# EAGLE design Omniboard (EAGLE 7.5.0)
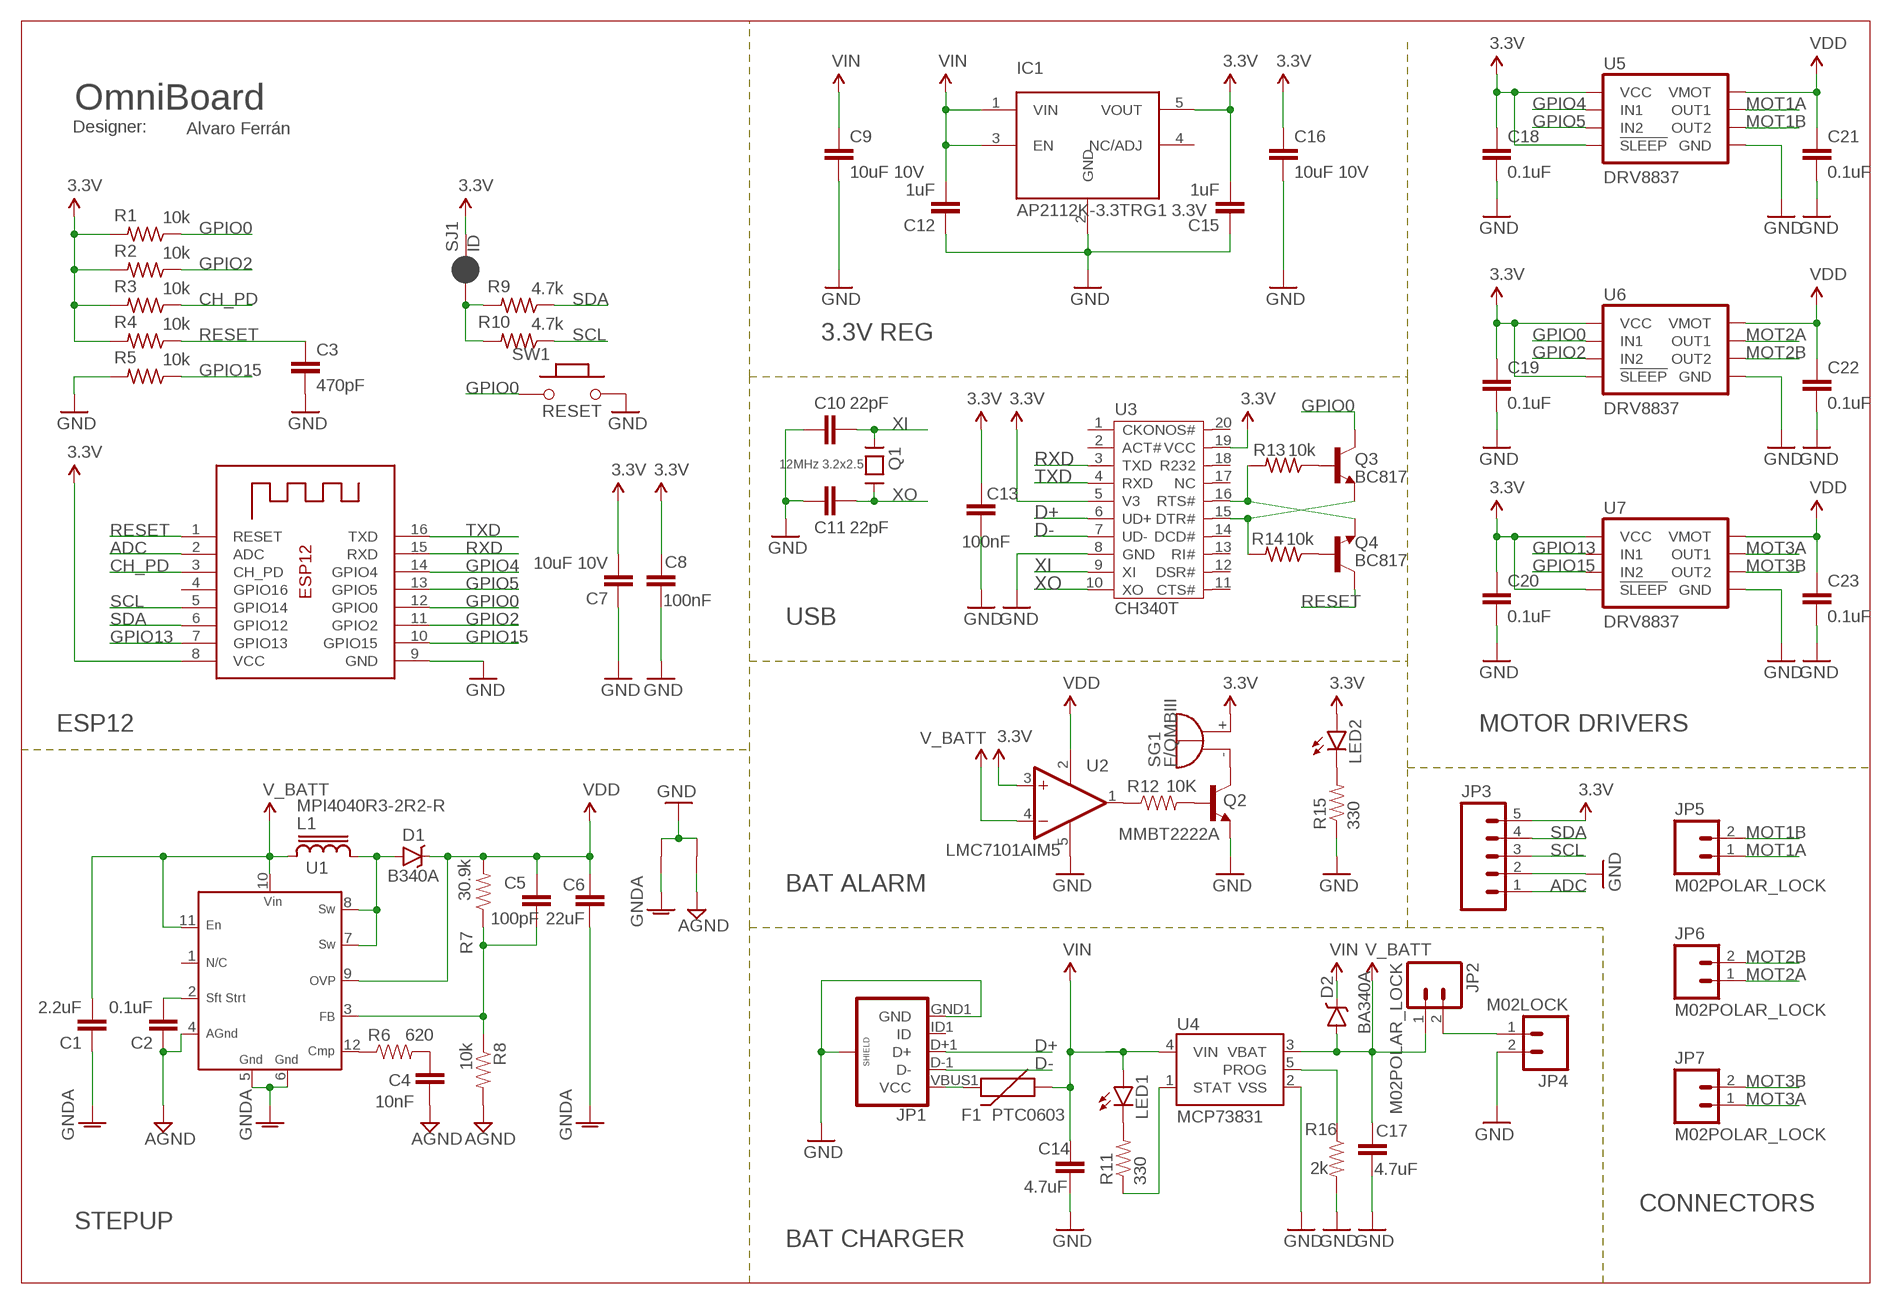
[diagram p0: schematic, sheet 1]

## Parts
C1  2.2uF  CAP0603-CAP  [0603-CAP]
C2  0.1uF  CAP0603-CAP  [0603-CAP]
C3  470pF  CAP0402-CAP  [0402-CAP]
C4  10nF  CAP0603-CAP  [0603-CAP]
C5  100pF  CAP0603-CAP  [0603-CAP]
C6  22uF  22UF-6.3V-20%(0805)  [0805]
C7  10uF 10V  CAP0402-CAP  [0402-CAP]
C8  100nF  CAP0402-CAP  [0402-CAP]
C9  10uF 10V  CAP0603-CAP  [0603-CAP]
C10  22pF  CAP0402-CAP  [0402-CAP]
C11  22pF  CAP0402-CAP  [0402-CAP]
C12  1uF  CAP0603-CAP  [0603-CAP]
C13  100nF  CAP0402-CAP  [0402-CAP]
C14  4.7uF  CAP0402-CAP  [0402-CAP]
C15  1uF  CAP0603-CAP  [0603-CAP]
C16  10uF 10V  CAP0603-CAP  [0603-CAP]
C17  4.7uF  CAP0402-CAP  [0402-CAP]
C18  0.1uF  0.1UF-16V(+-10%)(0402)  [0402-CAP]
C19  0.1uF  0.1UF-16V(+-10%)(0402)  [0402-CAP]
C20  0.1uF  0.1UF-16V(+-10%)(0402)  [0402-CAP]
C21  0.1uF  0.1UF-16V(+-10%)(0402)  [0402-CAP]
C22  0.1uF  0.1UF-16V(+-10%)(0402)  [0402-CAP]
C23  0.1uF  0.1UF-16V(+-10%)(0402)  [0402-CAP]
D1  B340A  DIODE-SCHOTTKY-B340A  [SMA-DIODE]
D2  BA340A  B340A  [SMA-DIODE]
F1  PTC0603  [0603]
GND10  VIRTUAL_GND  [STARGND]
GND13  VIRTUAL_GND  [STARGND]
IC1  AP2112K-3.3TRG1 3.3V  5PIN_REG  [SOT23-5]
JP1  USB_MICROB  USB_MICROB_PLUGCONN-11752  [USB-B-MICRO-SMD_V03]
JP2  M02POLAR_LOCK  [MOLEX-1X2_LOCK]
JP3  M05LOCK  [1X05_LOCK]
JP4  M02LOCK  [1X02_LOCK]
JP5  M02POLAR_LOCK  [MOLEX-1X2_LOCK]
JP6  M02POLAR_LOCK  [MOLEX-1X2_LOCK]
JP7  M02POLAR_LOCK  [MOLEX-1X2_LOCK]
L1  MPI4040R3-2R2-R  [MPI4040R3-2R2-R]
LED1  LED0603  [LED-0603]
LED2  LED0603  [LED-0603]
Q1  12MHz 3.2x2.5  CRYSTAL3.2X2.5  [CRYSTAL_3.2X2.5]
Q2  MMBT2222A  TRANSISTOR_NPNMMBT2222A  [SOT23-3]
Q3  BC817  BC817-16SMD  [SOT23-BEC]
Q4  BC817  BC817-16SMD  [SOT23-BEC]
R1  10k  R-US_R0402  [R0402]
R2  10k  R-US_R0402  [R0402]
R3  10k  R-US_R0402  [R0402]
R4  10k  R-US_R0402  [R0402]
R5  10k  R-US_R0402  [R0402]
R6  620  RESISTOR0603-RES  [0603-RES]
R7  30.9k  RESISTOR0603-RES  [0603-RES]
R8  10k  RESISTOR0603-RES  [0603-RES]
R9  4.7k  R-US_R0402  [R0402]
R10  4.7k  R-US_R0402  [R0402]
R11  330  RESISTOR0402-RES  [0402-RES]
R12  10K  RESISTOR0402-RES  [0402-RES]
R13  10k  R-US_R0402  [R0402]
R14  10k  R-US_R0402  [R0402]
R15  330  RESISTOR0402-RES  [0402-RES]
R16  2k  RESISTOR0402-RES  [0402-RES]
SG1  F/QMBIII  [F/QMBIII]
SJ1  ID  JUMPER-PAD-2-NC_BY_PASTE  [PAD-JUMPER-2-NC_BY_PASTE_YES_SILK]
SW1  RESET  PB157  [157SW]
U1  MIC2253  [MLF12_3.0MM_X_3.0MM]
U2  LMC7101AIM5  [SOT23-5]
U3  CH340T  [SSOP20]
U4  MCP73831  [SOT23-5]
U5  DRV8837  [DSG]
U6  DRV8837  [DSG]
U7  DRV8837  [DSG]
X1  ESP-12  [ESP-12]

## Nets
3.3V: C7.2 C8.1 C13.2 C15.2 C16.1 C18.1 C19.1 C20.1 IC1.5(VOUT) JP3.5 LED2.A R1.2 R2.2 R3.2 R4.2 SG1.+(-) SJ1.2 U2.3(+IN) U3.5(V3) U3.19(VCC) U5.7(!SLEEP) U5.8(VCC) U6.7(!SLEEP) U6.8(VCC) U7.7(!SLEEP) U7.8(VCC) X1.8(VCC)
ADC: JP3.1 X1.2(ADC)
AGND: C2.1 C4.1 GND13.P$1 R8.2 U1.4(AGND)
CH_PD: R3.1 X1.3(CH_PD)
D+: JP1.D+1(D+) U3.6(UD+)
D-: JP1.D-1(D-) U3.7(UD-)
GND: C3.2 C7.1 C8.2 C9.2 C10.1 C11.1 C12.1 C13.1 C14.2 C15.1 C16.2 C17.2 C18.2 C19.2 C20.2 C21.2 C22.2 C23.2 GND10.P$2 GND13.P$2 IC1.2(GND) JP1.GND1(GND) JP1.SHIELD1(SHIELD) JP1.SHIELD2(SHIELD) JP1.SHIELD3(SHIELD) JP3.2 JP4.2 Q2.2(E) R5.2 R15.1 R16.2 SW1.2 U2.5(V-) U3.8(GND) U4.2(VSS) U5.4(GND) U5.PAD(GND) U6.4(GND) U6.PAD(GND) U7.4(GND) U7.PAD(GND) X1.9(GND)
GPIO0: Q3.C R1.1 SW1.1 U6.6(IN1) X1.12(GPIO0)
GPIO2: R2.1 U6.5(IN2) X1.11(GPIO2)
GPIO4: U5.6(IN1) X1.14(GPIO4)
GPIO5: U5.5(IN2) X1.13(GPIO5)
GPIO13: U7.6(IN1) X1.7(GPIO13)
GPIO15: R5.1 U7.5(IN2) X1.10(GPIO15)
MOT1A: JP5.1 U5.2(OUT1)
MOT1B: JP5.2 U5.3(OUT2)
MOT2A: JP6.1 U6.2(OUT1)
MOT2B: JP6.2 U6.3(OUT2)
MOT3A: JP7.1 U7.2(OUT1)
MOT3B: JP7.2 U7.3(OUT2)
N$1: R9.2 R10.2 SJ1.1
N$2: Q3.E R14.2 U3.15(DTR#)
N$3: C4.2 R6.2
N$4: C2.2 U1.2(SS)
N$5: LED1.C R11.2
N$6: Q3.B R13.1
N$7: Q4.B R14.1
N$8: Q2.1(B) R12.2
N$9: Q2.3(C) SG1.-(+)
N$10: Q4.E R13.2 U3.16(RTS#)
N$11: R16.1 U4.5(PROG)
N$12: D1.A L1.P$2 U1.7(SW) U1.8(SW)
N$13: R11.1 U4.1(STAT)
N$14: F1.2 JP1.VBUS1(VCC)
N$15: LED2.C R15.2
N$16: R6.1 U1.12(CMP)
N$17: R12.1 U2.1(OUT)
N$24: C5.1 R7.1 R8.1 U1.3(FB)
PGND: C1.1 C6.1 GND10.P$1 U1.5(GND) U1.6(GND) ; supply symbol labelled GNDA
RESET: C3.1 Q4.C R4.1 X1.1(RESET)
RXD: U3.3(TXD) X1.15(RXD)
SCL: JP3.3 R10.1 X1.5(GPIO14)
SDA: JP3.4 R9.1 X1.6(GPIO12)
TXD: U3.4(RXD) X1.16(TXD)
V_BATT: C1.2 C17.1 D2.A JP2.1 L1.P$1 U1.10(VIN) U1.11(EN) U2.4(-IN) U4.3(VBAT)
VBAT: JP2.2 JP4.1
VDD: C5.2 C6.2 C21.1 C22.1 C23.1 D1.C R7.2 U1.9(OVP) U2.2(V+) U5.1(VMOT) U6.1(VMOT) U7.1(VMOT)
VIN: C9.1 C12.2 C14.1 D2.C F1.1 IC1.1(VIN) IC1.3(EN) LED1.A U4.4(VIN)
XI: C10.2 Q1.3 U3.9(XI)
XO: C11.2 Q1.1 U3.10(XO)
Unconnected: IC1.4(NC/ADJ) JP1.ID1(ID) U1.1(NC) U3.1(CKO) U3.2(ACT#) U3.11(CTS#) U3.12(DSR#) U3.13(RI#) U3.14(DCD#) U3.17(NC) U3.18(R232) U3.20(NOS#) X1.4(GPIO16)

## Notes on the sheet
- OmniBoard
- Designer: | Alvaro Ferrán
- 3.3V REG
- USB
- ESP12 | MOTOR DRIVERS
- BAT ALARM
- CONNECTORS
- STEPUP
- BAT CHARGER

## Library data of the parts
C1-C5 C7-C17 = SparkFun-Passives:CAP: Capacitor Standard 0603 ceramic capacitor, and 0.1" leaded capacitor.
C6 = SparkFun-Capacitors:22UF-6.3V-20%(0805): CAP-08402 Ceramic; PROD_ID: CAP-08402
C18-C23 = SparkFun-Capacitors:0.1UF-16V(+-10%)(0402); PROD_ID: CAP-12416
D1 = SparkFun-DiscreteSemi:DIODE-SCHOTTKY: Schottky diodes in SFE's production catalog BAT20J 1A 23V 0.62Vf RB751 120mA 40V 0.37Vf PMEG4005EJ 0.5A 40V 0.42Vf MBRA140 1A 40V 0.5Vf B340A 3A 40V SMA; PROD_ID: DIO-09886
D2 = SparkFun-DiscreteSemi:B340A: Schottky Diode 3A-40V; PROD_ID: DIO-09886
F1 = SparkFun-PowerIC:PTC: Resettable Fuse PTC Resettable Fuse. Spark Fun Electronics SKU : COM-08357
GND10 GND13 = alvaroferran:VIRTUAL_GND
IC1 = GHI:5PIN_REG
JP1 = SparkFun-Connectors:USB_MICROB_PLUG: USB Micro-B connectors Some male, some female. Watch your step!; PROD_ID: CONN-11752
JP2 JP4-JP7 = SparkFun-Connectors:M02: Standard 2-pin 0.1" header. Use with - straight break away headers ( PRT-00116) - right angle break away headers (PRT-00553) - swiss pins (PRT-00743) - machine pins (PRT-00117) - female headers (PRT-00115) Molex polarized connector foot print use with: PRT-08233 with associated crimp pins and housings. 2.54_SCREWTERM for use with PRT-10571. 3.5mm Screw Terminal footprints for PRT-08084 5mm Screw Terminal footprints for use with PRT-08432
JP3 = SparkFun-Connectors:M05: Header 5 Standard 5-pin 0.1" header. Use with straight break away headers (SKU : PRT-00116), right angle break away headers (PRT-00553), swiss pins (PRT-00743), machine pins (PRT-00117), and female headers (PRT-00115). Molex polarized connector foot print use with SKU : PRT-08230 with associated crimp pins and housings.
L1 = inductor-Eaton Bussmann:MPI4040R3-2R2-R
LED1 LED2 = SparkFun-LED:LED: LEDs Standard schematic elements and footprints for 5mm, 3mm, 1206, and 0603 sized LEDs. 5mm - Spark Fun Electronics SKU : COM-00529 (and others)
Q1 = GHI:CRYSTAL3.2X2.5
Q2 = SparkFun-DiscreteSemi:TRANSISTOR_NPN: Generic NPN BJT MMBT2222A - TRANS-08049 (SOT-23, 1A 40V) MPSA42 - TRANS-09116 (SOT-23, 500mA 300V) MMBT5088LT1G - TRANS-11160 (SOT-23, 50 mA 30V) BC547 - COM-08928 <http://www.sparkfun.com/products/8928> (TO-92 45V 100mA) (1.Collector 2.Base 3.Emitter) 2N3904 - COM-00521 <http://www.sparkfun.com/products/521> (TO-92 40V 200mA) (1.Emitter 2.Base 3.Collector) P2N2222A - COM-12852 <http://www.sparkfun.com/products/12852> (TO-92 40V 600mA) (1.Collector 2.Base 3.Emitter); PROD_ID: TRANS-08049
Q3 Q4 = transistor-npn:BC817*: NPN Transistor
R1-R5 R9 R10 R13 R14 = resistor:R-US_: RESISTOR, American symbol
R6-R8 R11 R15 R16 = SparkFun-Passives:RESISTOR: Resistor Basic schematic elements and footprints for 0603, 1206, and PTH resistors.
R12 = SparkFun:RESISTOR: Resistor Basic schematic elements and footprints for 0603, 1206, and PTH resistors.
SG1 = buzzer:F/QMBIII: BUZZER Source: Buerklin; OC_FARNELL: unknown; OC_NEWARK: unknown
SJ1 = SparkFun-Passives:JUMPER-PAD-2-NC_BY_PASTE
SW1 = MySMD:PB157
U1 = MIC2253_MLF12:MIC2253: MIC2253 - 3.5A, 1 MHz High Efficiency, Variable Voltage Inuput Boost Regulator with Over Voltage Protection and Soft-Start, Micrel 02-13-2013 - troneeee@gmail.com
U2 = linear:LMC7101AIM5
U3 = template:CH340T
U4 = SparkFun-PowerIC:MCP73831: Miniature single cell, fully integrated Li-Ion, Li-polymer charge management controller http://ww1.microchip.com/downloads/en/DeviceDoc/21984a.pdf IC-09995; PROD_ID: IC-09995
U5-U7 = packages(ti):DRV8837
X1 = microbuilder:ESP-12

## Net classes
0 default: width 0.254 mm, drill 0.254 mm, clearance 0.203 mm

## Board
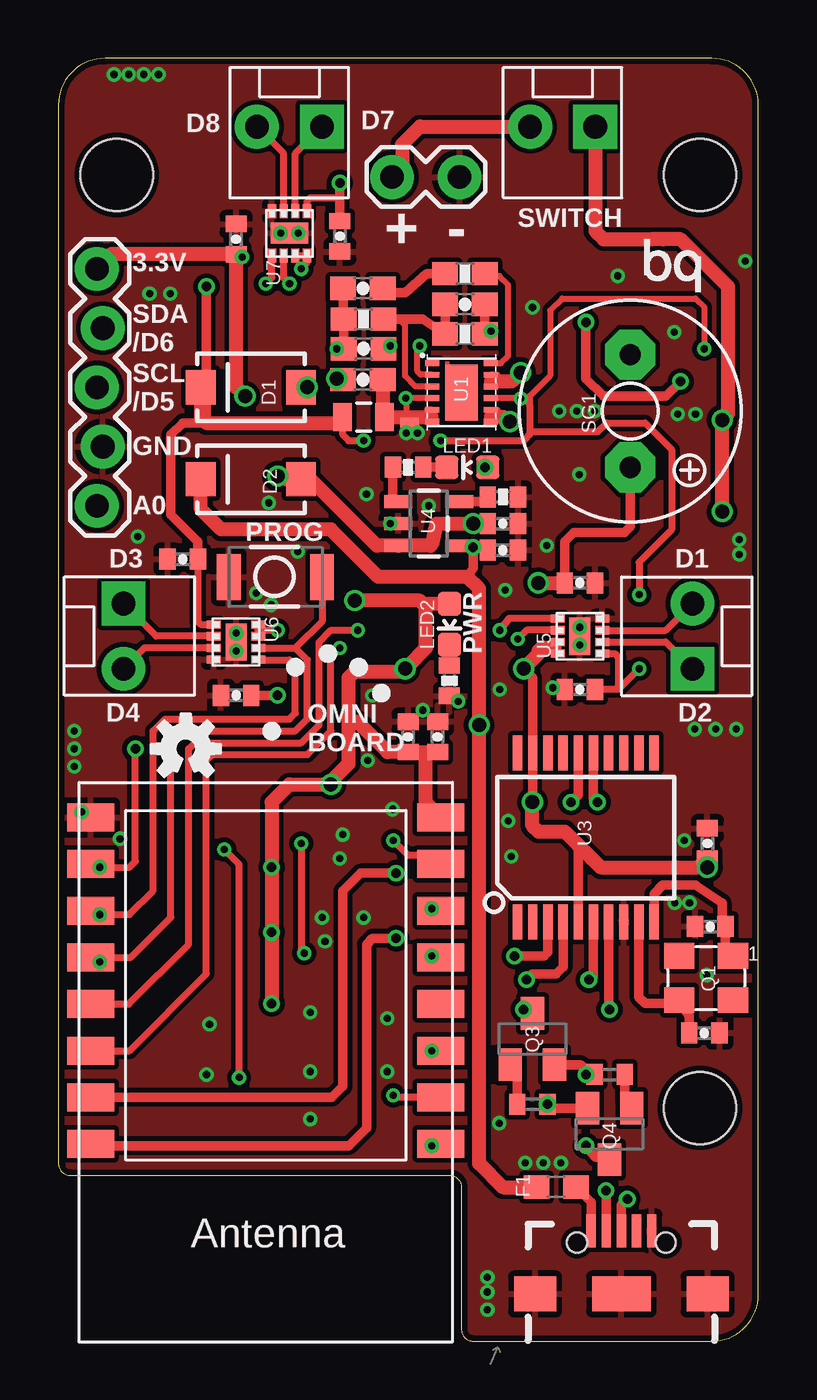
[diagram p1: board, top side]
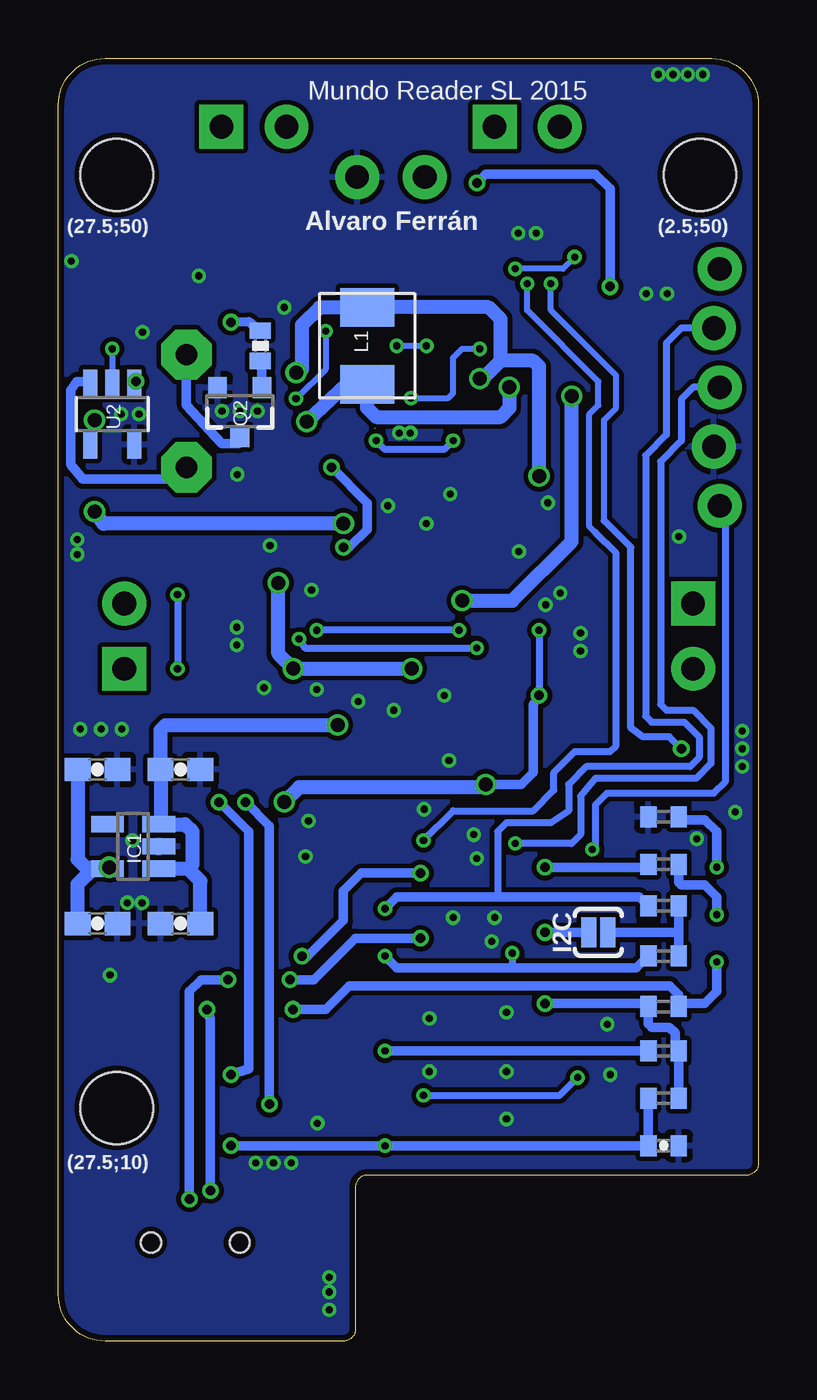
[diagram p2: board, bottom side, seen from below]

Size 30 x 55 mm. Coordinates in mm from the lower left corner, seen from the top.
Outline: 17.78,0 28,0 arc90 30,2 30,53 arc90 28,55 2,55 arc90 0,53 0,7.62 arc90 0.51,7.11 16.76,7.11 arc-90 17.27,6.6 17.27,0.51 arc90 17.78,0
Copper layers (1*16): Top 0.035mm / dielectric 1.5mm / Bottom 0.035mm
Design rules "pighixxx_CAM_DRC_V1.0": minimum track width 6mil, minimum drill 12mil, track to track 6mil, track to pad 6mil, pad to pad 6mil, via to via 6mil, smd to smd 0mil, copper to edge 10mil, drill to drill 10mil, minimum pad ring 10mil, minimum via ring 6mil, stop-mask expansion 2mil, vias tented up to drill 100mil, thermal gap 10mil
Holes 3.1 mm at 2.5,50 27.5,50 27.5,10

### Footprints (pad centres in the part's own frame; a part is rotated, then mirrored left to right if it is on the bottom)
0603-CAP = smd 1.1 x 1: 1 -0.85,0; 2 0.85,0
0402-CAP = smd 0.7 x 0.9: 1 -0.65,0; 2 0.65,0
0805 = smd 0.8 x 1.2: 1 -0.9,0; 2 0.9,0
SMA-DIODE = smd 1.27 x 1.47: A -2.15,0; C 2.15,0
0603 = smd 1.1 x 1: 1 -0.85,0; 2 0.85,0
STARGND = smd 0.203 x 0.406: P$1 -0.102,0; P$2 0.102,0
SOT23-5 = smd 0.7 x 1.4: 1 0.95,1.1; 2 0,1.1; 3 -0.95,1.1; 4 -0.95,-1.1; 5 0.95,-1.1
USB-B-MICRO-SMD_V03 = smd 1.4 x 0.4: D+1 2.7,0; D-1 2.7,0.65; GND1 2.7,-1.3; ID1 2.7,-0.65; VBUS1 2.7,1.3 | smd 1.5 x 1.8: SHIELD1 0,3.7; SHIELD2 0,-3.7 | smd 1.5 x 2.5: SHIELD3 0,0 | hole 0.85: 2.2,1.9; 2.2,-1.9
MOLEX-1X2_LOCK = drill 1.016 pad 1.88 square: 1 -0.127,0 | drill 1.016 pad 1.88: 2 2.667,0
1X05_LOCK = drill 1.016 pad 1.88: 1 0,0.127; 2 2.54,-0.127; 3 5.08,0.127; 4 7.62,-0.127; 5 10.16,0.127
1X02_LOCK = drill 1.016 pad 1.88: 1 -0.178,0; 2 2.718,0
MPI4040R3-2R2-R = smd 1.65 x 2.3: P$1 -1.645,0; P$2 1.645,0
LED-0603 = smd 1 x 1: A 0,-0.877; C 0,0.877
CRYSTAL_3.2X2.5 = smd 1.3 x 1.1: 1 -1.1,-0.9; 2 1.2,-0.9; 3 1.2,1; 4 -1.1,1
SOT23-3 = smd 0.8 x 0.9: 1 -0.95,-1; 2 0.95,-1; 3 0,1.1
SOT23-BEC = smd 1 x 1.4: B -0.95,-1.1; C 0,1.1; E 0.95,-1.1
R0402 = smd 0.7 x 0.9: 1 -0.65,0; 2 0.65,0
0603-RES = smd 1.1 x 1: 1 -0.85,0; 2 0.85,0
0402-RES = smd 0.7 x 0.9: 1 -0.65,0; 2 0.65,0
F/QMBIII = drill 0.914 pad 2.159 octagon: + 2.416,0; - -2.416,0
PAD-JUMPER-2-NC_BY_PASTE_YES_SILK = smd 0.635 x 1.27: 1 -0.401,0; 2 0.413,0
157SW = smd 1.016 x 1.981: 1 0,0; 2 4,0
MLF12_3.0MM_X_3.0MM = smd 0.6 x 0.25: 1 -1.244,1.291; 2 -1.242,0.79; 3 -1.242,0.29; 4 -1.242,-0.21; 5 -1.242,-0.71; 6 -1.242,-1.21; 7 1.265,-1.211; 8 1.265,-0.711; 9 1.265,-0.211; 10 1.265,0.289; 11 1.265,0.789; 12 1.266,1.29 | smd 1.4 x 2.4: EXP 0.01,0.038
SOT23-5' = smd 0.6 x 1.2: 1 -0.95,-1.306; 2 0,-1.306; 3 0.95,-1.306; 4 0.95,1.306; 5 -0.95,1.306
SSOP20 = smd 0.4 x 1.5: 1 -2.925,-3.625; 2 -2.275,-3.625; 3 -1.625,-3.625; 4 -0.975,-3.625; 5 -0.325,-3.625; 6 0.325,-3.625; 7 0.975,-3.625; 8 1.625,-3.625; 9 2.275,-3.625; 10 2.925,-3.625; 11 2.925,3.625; 12 2.275,3.625; 13 1.625,3.625; 14 0.975,3.625; 15 0.325,3.625; 16 -0.325,3.625; 17 -0.975,3.625; 18 -1.625,3.625; 19 -2.275,3.625; 20 -2.925,3.625
SOT23-5'' = smd 0.55 x 1.2: 1 -0.95,-1.3; 2 0,-1.3; 3 0.95,-1.3; 4 0.95,1.3; 5 -0.95,1.3
DSG = smd 0.6 x 0.35: 1 -0.95,0.75; 2 -0.95,0.25; 3 -0.95,-0.25; 4 -0.95,-0.75; 5 0.95,-0.75; 6 0.95,-0.25; 7 0.95,0.25; 8 0.95,0.75 | smd 0.9 x 1.6: PAD 0,0
ESP-12 = smd 2 x 1.2: 1 -7.5,4.5; 2 -7.5,2.5; 3 -7.5,0.5; 4 -7.5,-1.5; 5 -7.5,-3.5; 6 -7.5,-5.5; 7 -7.5,-7.5; 8 -7.5,-9.5; 9 7.5,-9.5; 10 7.5,-7.5; 11 7.5,-5.5; 12 7.5,-3.5; 13 7.5,-1.5; 14 7.5,0.5; 15 7.5,2.5; 16 7.5,4.5

### Placement (x,y rotation side)
C1  13.06,41.22 180 top
C2  13.08,42.55 0 top
C3  4.06,8.38 0 bottom
C4  13.06,45.14 0 top
C5  17.42,44.45 0 top
C6  13.08,39.62 180 top
C7  14.99,25.91 270 top
C8  16.26,25.91 90 top
C9  24.77,17.91 180 bottom
C10  27.69,13.21 180 top
C11  27.94,17.78 0 top
C12  24.77,24.51 180 bottom
C13  27.81,21.34 270 top
C14  19.05,33.91 0 top
C15  28.32,24.51 180 bottom
C16  28.32,17.91 0 bottom
C17  19.05,35.05 0 top
C18  7.62,27.69 180 top
C19  22.35,32.51 0 top
C20  7.62,47.24 90 top
C21  22.35,27.94 180 top
C22  5.33,33.53 180 top
C23  12.06,47.37 270 top
D1  8.26,40.89 180 top
D2  8.26,36.96 180 top
F1  21.34,6.6 0 top
GND10  15.24,39.37 270 top
GND13  14.86,39.37 270 top
IC1  26.8,21.21 270 bottom
JP1  24.13,2.03 90 top
JP2  22.89,52.07 180 top
JP3  1.78,35.81 90 top
JP4  14.48,49.91 0 top
JP5  27.18,28.96 90 top
JP6  2.79,31.5 270 top
JP7  11.18,52.07 180 top
L1  16.76,42.67 270 bottom
LED1  17.53,37.47 90 top
LED2  16.76,30.73 180 top
Q1  27.81,15.62 180 top
Q2  22.23,39.88 180 bottom
Q3  20.32,12.95 0 top
Q4  23.62,8.89 180 top
R1  4.06,14.35 180 bottom
R2  4.06,20.45 180 bottom
R3  4.06,12.45 0 bottom
R4  4.06,10.41 0 bottom
R5  4.06,22.48 180 bottom
R6  17.42,45.77 180 top
R7  17.42,43.18 0 top
R8  13.08,43.81 180 top
R9  4.06,18.67 0 bottom
R10  4.06,16.51 0 bottom
R11  14.99,37.47 0 top
R12  21.34,42.67 270 bottom
R13  20.32,10.16 0 top
R14  23.62,11.43 180 top
R15  16.76,28.32 90 top
R16  19.05,36.2 0 top
SG1  24.51,39.88 270 top
SJ1  6.86,17.53 180 bottom
SW1  11.3,32.77 180 top
U1  17.27,40.64 0 top
U2  LMC7101AIM5  [SOT23-5']  27.69,39.75 180 bottom
U3  22.61,21.59 0 top
U4  MCP73831  [SOT23-5'']  15.88,35.05 270 top
U5  22.35,30.23 180 top
U6  7.62,29.97 0 top
U7  9.91,47.5 270 top
U$1  [OSHW-LOGO-S]  5.46,25.4 0 top
U$3  [BQ_LOGO_SMALL_2]  8.76,25.53 0 top
U$4  [BQ_LOGO_SMALL_1]  26.29,45.47 0 top
X1  8.89,12.95 180 top

### Tracks (layer width: path | path; a pad name or v marks a point on that pad's centre or on a via)
3.3V  (via drill 0.3, 0.41, 0.6)
  Top 0.254: 7.61,46.61 7.73,46.48 v7.87,46.48 | v10.41,45.97 10.66,46.22 U7.8
  Top 0.305: U7.7 U7.8 | U5.8 U5.7 21.14,29.72 | U6.8 U6.7 8.83,30.48 v9.4,30.48
  Top 0.406: v9.4,27.69 C18.1 | U3.5 22.28,21.27 | v19.94,28.83 20.33,28.44 U3.19 20.33,23.12 v20.32,23.11 | v14.86,28.83 14.99,28.96 | 20.57,29.59 20.57,29.46 | C19.1 21.7,34.27 22.1,34.67 24.26,34.67 24.51,34.92 SG1.+
  Top 0.61: 21.14,29.72 20.7,29.72 20.57,29.59 | v20.57,32.51 C19.1 | 15.75,25.26 C7.2 14.11,25.26 12.83,26.54 12.45,26.54 | 15.75,25.26 C8.1 | X1.8 15.75,23.1 15.75,25.26 | v9.14,14.48 v9.14,17.53 v9.14,20.32 9.14,23.11 9.91,23.88 11.56,23.88 | 11.56,23.88 v11.68,23.88 | 12.45,26.54 12.45,24.77 11.56,23.88 | 12.45,26.54 12.45,28.45 12.7,28.7 14.73,28.7 14.99,28.96 15.75,29.72 15.75,31.5 | 15.75,31.5 15.49,31.75 v12.7,31.75 | 20.57,29.46 v19.94,28.83 | v20.32,23.11 20.32,22.1 20.57,21.84 21.7,21.84 22.28,21.27 22.86,20.69 23.24,20.32 27.43,20.32 C13.2 v27.81,20.32 | JP3.5 2.29,46.61 7.61,46.61 C20.1 7.62,40.89 v8,40.51 | LED2.A 15.86,31.61 15.75,31.5
  Bottom 0.254: v7.87,46.48 8.38,45.97 v10.41,45.97
  Bottom 0.305: v9.4,30.48 v9.4,27.69
  Bottom 0.406: R4.2 R3.2 3.56,12.59 3.56,13.21 3.81,13.46 4.57,13.46 4.71,13.6 R1.2 4.84,14.48 v9.14,14.48 | R2.2 4.84,20.32 v9.14,20.32 | SJ1.2 v9.14,17.53 | v9.4,27.69 9.65,27.3 9.65,24.38 10.16,23.88 v11.68,23.88 | SG1.+ 24.64,37.46 25.15,36.96 28.96,36.96 29.46,37.59 29.46,40.77 29.21,41.15 28.73,41.15 U2.3
  Bottom 0.61: v20.57,32.51 20.57,29.46 v19.94,28.83 v14.86,28.83 | C15.2 29.17,20.66 28.83,20.32 28.45,20.32 | 28.45,20.32 27.96,20.32 IC1.5 27.87,20.26 v27.81,20.32 | C16.1 29.17,19.6 28.45,20.32 | v11.68,23.88 11.81,23.75 19.68,23.75 v20.32,23.11 | v12.7,31.75 10.54,31.75 8,34.29 v8,40.51
ADC  (via drill 0.3)
  Top 0.305: X1.2 14.44,10.45 v14.35,10.54 | v7.75,11.3 7.75,20.45 v7.11,21.08
  Bottom 0.305: v14.35,10.54 8.51,10.54 v7.75,11.3 | v7.11,21.08 6.99,21.21 6.99,22.99 6.48,23.5 1.91,23.5 1.4,24 1.4,35.56 JP3.1
AGND  (via drill 0.3)
  Top 0.254: U1.4 14.9,40.43 | 14.9,40.43 v14.88,40.44 | v11.94,42.55 C2.1 | 14.9,40.43 14.9,39.52 arc-90 GND13.P$1
  Top 0.406: C4.1 12.21,43.84 R8.2 C2.1
  Bottom 0.254: v14.88,40.44 13.28,40.44 13.08,40.64 13.08,42.16 12.7,42.55 v11.94,42.55
CH_PD  (via drill 0.3)
  Top 0.406: v16,12.45 v16.01,12.45 X1.3
  Bottom 0.406: R3.1 v16,12.45
D+  (via drill 0.41)
  Top 0.406: JP1.D+1 24.13,5.84 v24.38,6.1 | U3.6 22.93,15.56 v22.73,15.49
  Bottom 0.406: v24.38,6.1 24.38,14.99 23.88,15.49 v22.73,15.49
D-  (via drill 0.41)
  Top 0.406: JP1.D-1 v23.48,6.46 | U3.7 23.58,14.52 v23.62,14.22
  Bottom 0.406: v23.48,6.46 23.48,13.83 v23.62,14.22
GND  (via drill 0.3)
  Top 0.254: GND10.P$2 GND13.P$2 14.86,38.96 arc-90 v14.91,38.94 | 15.24,39.37 15.37,39.24 15.37,38.96 arc-90 v15.39,38.94
  other vias: 27.05,18.8 26.42,18.8 0.69,24.64 0.69,25.4 0.69,26.16 11.3,18.16 11.43,17.14 13.08,18.16 12.06,20.7 12.19,21.72 10.79,14.1 10.79,11.56 10.79,9.53 7.62,30.35 7.62,29.59 22.35,30.61 22.35,29.84 9.53,47.5 10.29,47.5 26.54,39.75 27.3,39.75 26.82,21.46 17.14,27.43 18.92,27.94 13.26,24.89 6.48,13.59 6.35,11.43 14.1,13.84 14.1,11.56 22.23,39.88 21.46,39.88 22.99,39.88 15.88,35.81 20.32,44.32 2.64,21.54 0.99,22.68 19.41,20.78 19.28,22.3 29.18,33.73 29.18,34.37 23.98,45.67 29.44,46.3 26.39,43.26 22.33,37.16 20.93,34.11 3.02,54.31 2.39,54.31 3.66,54.31 4.29,54.31 3.91,44.91 4.8,44.91 3.4,34.49 14.33,22.81 18.39,2.11 18.39,1.35 18.39,2.74 27.79,15.7 29.06,26.24 28.17,26.24 27.28,26.24 13.46,27.69 18.9,9.35 21.54,7.65 20.78,7.65 20.02,7.65 15.62,27.05 13.21,36.32 14.22,35.05 19.15,32.21 21.18,28.02 8.48,32.08 10.26,33.86 9.12,31.57 9.02,35.94
  pour Top: -2.03,55.88 32,55.88 31.5,-3.05 -2.54,-3.05
  pour Bottom: -1.52,56.9 30.99,56.9 30.99,-2.03 -1.52,-2.03
GPIO0  (via drill 0.3, 0.41)
  Top 0.305: U6.6 10.16,29.72 | 1.58,16.45 3.1,16.45 4.83,18.18 4.83,25.91 5.08,26.16 10.16,26.16 10.67,26.67 10.67,29.21 10.16,29.72 | SW1.1 11.3,30.86 10.16,29.72
  Top 0.406: v1.78,16.26 1.58,16.45 X1.12 | v19.94,14.22 20.15,14.22 Q3.C
  Bottom 0.406: v1.78,16.26 1.78,14.99 2.29,14.48 3.29,14.48 R1.1 3.41,14.84 3.56,14.99 3.79,15.24 17.53,15.24 18.54,14.22 v19.94,14.22
GPIO2  (via drill 0.3)
  Top 0.305: U6.5 8.58,29.21 9.91,29.21 10.16,28.96 10.16,26.92 9.91,26.67 4.57,26.67 4.06,26.16 4.06,19.3 3.05,18.29 v1.78,18.29
  Top 0.406: v1.78,18.29 1.61,18.45 X1.11
  Bottom 0.406: R2.1 3.41,19.67 3.3,19.56 2.29,19.56 1.78,19.05 v1.78,18.29
GPIO4  (via drill 0.3)
  Top 0.305: U5.6 20.07,30.48 v19.68,30.1 | X1.14 3.06,12.45 6.35,15.75 6.35,24.89 6.6,25.15 10.67,25.15 11.68,26.16 11.68,29.34 v12.06,29.72
  Bottom 0.305: v19.68,30.1 19.43,29.72 v12.06,29.72
GPIO5  (via drill 0.3)
  Top 0.305: U5.5 19.3,30.99 v18.92,30.48 | X1.13 3.02,14.45 5.59,17.02 5.59,25.4 5.84,25.65 10.41,25.65 11.18,26.42 11.18,29.97 11.68,30.48 v12.83,30.48
  Bottom 0.305: v12.83,30.48 v18.92,30.48
GPIO13  (via drill 0.3)
  Top 0.305: U7.6 9.66,45.59 v9.91,45.34 | 16.02,20.83 14.99,20.83 v14.35,21.46
  Top 0.406: X1.7 16.02,20.83
  Bottom 0.254: 6.99,34.67 7.24,34.92 7.24,39.75 6.86,40.13 6.86,41.15 9.91,44.2 v9.91,45.34
  Bottom 0.305: v14.35,21.46 13.08,22.73 9.65,22.73 8.76,23.62 8.76,24.38 7.87,25.27 6.35,25.27 6.1,25.53 6.1,33.78 6.99,34.67
GPIO15  (via drill 0.3, 0.41)
  Top 0.305: 9.14,46.54 U7.5 9.16,45.6 v8.89,45.34 | v1.78,20.32 3.05,20.32 3.3,20.57 v3.3,25.4
  Top 0.406: v1.78,20.32 1.64,20.45 X1.10
  Bottom 0.254: 6.6,35.18 6.6,39.5 6.1,40.01 6.1,41.4 8.89,44.2 v8.89,45.34
  Bottom 0.305: 6.6,35.18 5.46,34.04 5.46,26.29 4.95,25.91 3.81,25.91 v3.3,25.4
  Bottom 0.406: R5.1 3.29,22.35 2.29,22.35 1.78,21.84 v1.78,20.32
MOT1A
  Top 0.305: U5.2 26.03,29.98 JP5.1
MOT1B
  Top 0.305: U5.3 26.03,30.48 JP5.2
MOT2A
  Top 0.305: U6.2 4.2,30.22 JP6.1
MOT2B
  Top 0.305: U6.3 3.69,29.72 JP6.2
MOT3A
  Top 0.305: U7.2 10.16,50.92 JP7.1
MOT3B
  Top 0.305: U7.3 9.66,50.92 JP7.2
N$1
  Bottom 0.406: R9.2 3.41,17.53 | 3.41,17.53 R10.2 | SJ1.1 3.41,17.53
N$2  (via drill 0.41)
  Top 0.406: Q3.E 22.38,11.85 R14.2 22.86,11.54 v22.61,11.43 | U3.15 22.93,23.3 v23.11,23.11
  Bottom 0.406: v23.11,23.11 21.84,21.84 21.84,11.68 v22.61,11.43
N$3
  Top 0.406: R6.2 15.8,45.77 14.86,44.96 13.96,44.96 C4.2
N$4  (via drill 0.3)
  Top 0.254: U1.2 15.54,41.43 15.39,41.58 15.39,42.7 v15.49,42.67 | v14.22,42.67 14.19,42.8 C2.2
  Bottom 0.254: v15.49,42.67 v14.22,42.67
N$5
  Top 0.406: R11.2 LED1.C
N$6
  Top 0.406: Q3.B 19.67,12.06 R13.1
N$7
  Top 0.406: Q4.B 24.27,10.29 R14.1
N$8
  Bottom 0.406: R12.2 21.27,41.58 Q2.1
N$9
  Bottom 0.406: Q2.3 22.27,38.48 22.99,38.48 24.51,40.13 SG1.-
N$10  (via drill 0.41)
  Top 0.406: Q4.E 21.14,9.99 R13.2 21.08,10.27 v20.95,10.16 | U3.16 22.28,23.42 v21.97,23.11
  Bottom 0.406: v20.95,10.16 20.95,22.1 v21.97,23.11
N$11
  Top 0.406: U4.5 18.15,36 R16.1
N$12  (via drill 0.6)
  Top 0.254: 18.82,39.93 U1.8 U1.7 | 18.78,39.43 U1.7 | U1.7 18.54,39.62
  Top 0.61: v19.36,39.42 19.05,39.62 18.54,39.62 | v10.67,40.89 D1.A
  Bottom 0.61: v19.36,39.42 17.65,41.03 L1.P$2 16.76,40.01 16.38,39.62 11.05,39.62 10.67,40.01 v10.67,40.89
N$13
  Top 0.406: R11.1 14.34,36.24 U4.1
N$14
  Top 0.406: JP1.VBUS1 22.83,5.96 F1.2
N$15
  Top 0.61: LED2.C R15.2
N$16
  Top 0.254: U1.12 18.97,41.93 19.28,42.24 19.28,45.29 18.9,45.67 R6.1
N$17  (via drill 0.41)
  Top 0.406: v26.67,41.15 26.04,40.51 23.37,40.51 22.61,41.27 v22.61,43.69
  Bottom 0.406: U2.1 26.7,40.89 v26.67,41.15 | v22.61,43.69 21.83,43.7 R12.1
N$24
  Top 0.254: U1.3 15.31,40.93 14.86,41.38 14.86,43.56 14.61,43.81 R8.1
  Top 0.406: R8.1 15.62,43.81 R7.1 C5.1
PGND
  Top 0.254: U1.5 15.8,39.93 15.77,39.65 15.74,39.43 15.81,39.43 | 16,39.62 15.81,39.43 | 15.81,39.43 U1.6 arc90 15.99,39.47 GND10.P$1
  Top 0.406: 13.91,39.7 C6.1
  Top 0.61: C6.1 16,39.62 | C1.1 13.91,39.7
RESET  (via drill 0.3, 0.41)
  Top 0.406: v16,8.38 16.07,8.45 X1.1 | Q4.C 23.03,7.87 v22.61,8.38
  Bottom 0.406: R4.1 C3.1 v16,8.38 v22.61,8.38
RXD  (via drill 0.41)
  Top 0.406: U3.3 20.98,16.66 20.83,16.51 v19.56,16.51 | v14.48,20.07 12.95,20.07 12.19,19.3 12.19,10.92 11.72,10.45 X1.15
  Bottom 0.406: v19.56,16.51 19.3,16.51 17.78,18.03 17.78,19.3 17.02,20.07 v14.48,20.07
SCL  (via drill 0.3)
  Top 0.305: v10.41,21.34 10.41,16.76 v10.54,16.64
  Top 0.406: v16,16.51 16.06,16.45 X1.5
  Bottom 0.305: v10.41,21.34 8,21.34 7.62,21.72 7.62,23.37 6.99,24.13 2.67,24.13 2.03,24.77 2.03,26.29 2.79,27.05 3.94,27.05 4.19,27.3 4.19,37.72 3.3,38.61 3.3,40.39 2.79,40.89 JP3.3 | v10.54,16.64 10.54,16
  Bottom 0.406: R10.1 5.22,16 10.54,16 15.49,16 v16,16.51
SDA  (via drill 0.3)
  Top 0.406: v16,18.54 16.09,18.45 X1.6
  Bottom 0.305: 11.18,19.05 11.18,21.84 10.79,22.23 8.89,22.23 8.13,22.73 8.13,23.88 7.37,24.64 2.92,24.64 2.54,25.02 2.54,25.91 3.17,26.54 4.57,26.54 4.83,26.8 4.83,37.97 3.94,38.86 3.94,42.8 3.3,43.43 JP3.4
  Bottom 0.406: R9.1 5.09,19.05 11.18,19.05 15.49,19.05 v16,18.54
TXD  (via drill 0.41)
  Top 0.406: U3.4 21.63,16.04 21.34,15.75 20.32,15.75 v20.07,15.49 | v14.48,17.27 13.46,17.27 13.21,17.02 13.21,9.14 12.45,8.38 1.46,8.38 X1.16
  Bottom 0.406: v20.07,15.49 19.05,15.49 17.27,17.27 v14.48,17.27
V_BATT  (via drill 0.6)
  Top 0.254: U1.11 18.82,41.43 | 18.78,40.93 U1.10 | 18.67,41.43 U1.11 | U1.11 U1.10 | U1.10 18.54,41.15 | C1.2 12.15,41.27 v11.94,41.27
  Top 0.406: 14.64,34.16 U4.3 | C17.1 v17.78,35.05 | 28.45,39.24 v28.45,39.5
  Top 0.61: v28.45,39.5 28.7,39.75 28.7,45.21 26.67,47.24 25.91,47.24 25.4,47.24 23.37,47.24 23.01,47.6 JP2.1 | v28.45,35.56 28.45,39.24 | v17.78,35.05 16.2,35.05 16,34.16 15.94,34.1 U4.3 13.65,34.1 10.79,36.96 D2.A 9.78,36.96 v9.4,37.08 | v19.81,41.53 19.43,41.15 18.54,41.15 | 12.03,41.4 v11.94,41.27
  Bottom 0.406: U2.4 28.51,39.3 v28.45,39.5
  Bottom 0.61: v17.78,35.05 28.07,35.05 v28.45,35.56 | v19.81,41.53 19.56,41.66 19.56,43.56 18.8,44.32 L1.P$1 15.87,44.32 11.56,44.32 11.05,43.81 11.05,42.04 | 11.05,42.04 11.68,41.4 v11.94,41.27 | v9.4,37.08 9.4,41.78 9.65,42.04 11.05,42.04
VBAT
  Top 0.61: JP4.1 14.73,50.34 14.73,51.31 15.49,52.07 JP2.2
VDD  (via drill 0.3, 0.41)
  Top 0.254: v18.54,43.31 18.66,43.43 R7.2 | 20.19,40.13 19.91,40.41 v19.81,40.41 19.79,40.43 U1.9 | 20.19,38.86 19.94,38.61 | 12.19,39.61 C6.2 | v27.69,42.55 27.69,44.32 27.3,44.7 21.59,44.7 21.08,44.2 21.08,41.4 20.19,40.51
  Top 0.305: C22.1 5.98,30.85 6.1,30.73 6.66,30.73 U6.1 | U7.1 10.67,48.9 10.79,49.02 11.94,49.02 12.06,48.9 C23.1 | 20.19,38.86 20.19,40.13 20.19,40.51 | 12.19,39.61 12.19,38.86 12.45,38.61 v13.08,38.61 | v16.38,38.61 19.94,38.61 20.32,38.99 23.11,38.99 23.5,39.37 25.15,39.37 26.29,38.23 26.29,34.8 24.89,33.4 v24.89,32 | U5.1 23.86,29.48 24,29.34 24,28.07 23.88,27.94 | 23.88,27.94 23.5,27.94 C21.1 | v24.89,28.83 24,27.94 23.88,27.94
  Top 0.406: C5.2 R7.2 | v6.35,45.21 6.35,39.37 5.33,39.37 4.83,38.86 4.83,35.43 5.97,34.29 5.97,33.54 C22.1 | v12.06,49.66 C23.1
  Top 0.61: D1.C 6.11,39.62 6.35,39.37 11.93,39.37 C6.2
  Bottom 0.254: v18.54,43.31 18.54,41.66 v19.81,40.41 | v27.69,42.55 U2.2
  Bottom 0.305: v13.08,38.61 13.46,38.23 16,38.23 v16.38,38.61 | v24.89,32 v24.89,28.83
  Bottom 0.406: v6.35,45.21 6.35,49.4 6.99,50.04 11.68,50.04 v12.06,49.66
VIN  (via drill 0.41, 0.6)
  Top 0.406: C14.1 18.27,34.1 U4.4 17.71,34.1 v17.78,34.04 17.78,33.15 17.53,32.77 | v18.29,37.47 18.28,37.34 LED1.A
  Top 0.61: F1.1 19.05,6.6 18.03,7.62 v18.03,26.42 18.03,32.26 17.53,32.77 13.72,32.77 11.68,34.8 6.99,34.8 6.11,35.68 D2.C
  Bottom 0.406: v17.78,34.04 17.53,34.04 16.76,34.8 16.76,35.94 v18.29,37.47
  Bottom 0.61: 24.45,20.26 24.26,20.45 24.26,21.84 24.57,22.16 IC1.3 25.61,22.24 C12.2 25.61,26.2 25.4,26.42 v18.03,26.42 | IC1.1 24.45,20.26 | C9.1 23.91,19.73 24.45,20.26
XI
  Top 0.406: C10.2 27.04,13.94 Q1.3 26.5,14.48 25.15,14.48 24.88,14.74 U3.9
XO
  Top 0.406: Q1.1 28.59,16.59 C11.2 28.45,17.67 28.45,18.8 27.3,19.56 25.91,19.56 25.53,19.18 U3.10

### Text on the board
tPlace: D8 | D7 | SWITCH | + | - | 3.3V | SDA / /D6 | SCL / /D5 | GND | A0 | PROG | D3 | D1 | PWR | D4 | D2 | OMNI / BOARD
bPlace: Mundo Reader SL 2015 | Alvaro Ferrán | (2.5;50) | (27.5;50) | I2C | (27.5;10)
bNames: L1